# EAGLE design deadlocks (EAGLE 8.7.1)
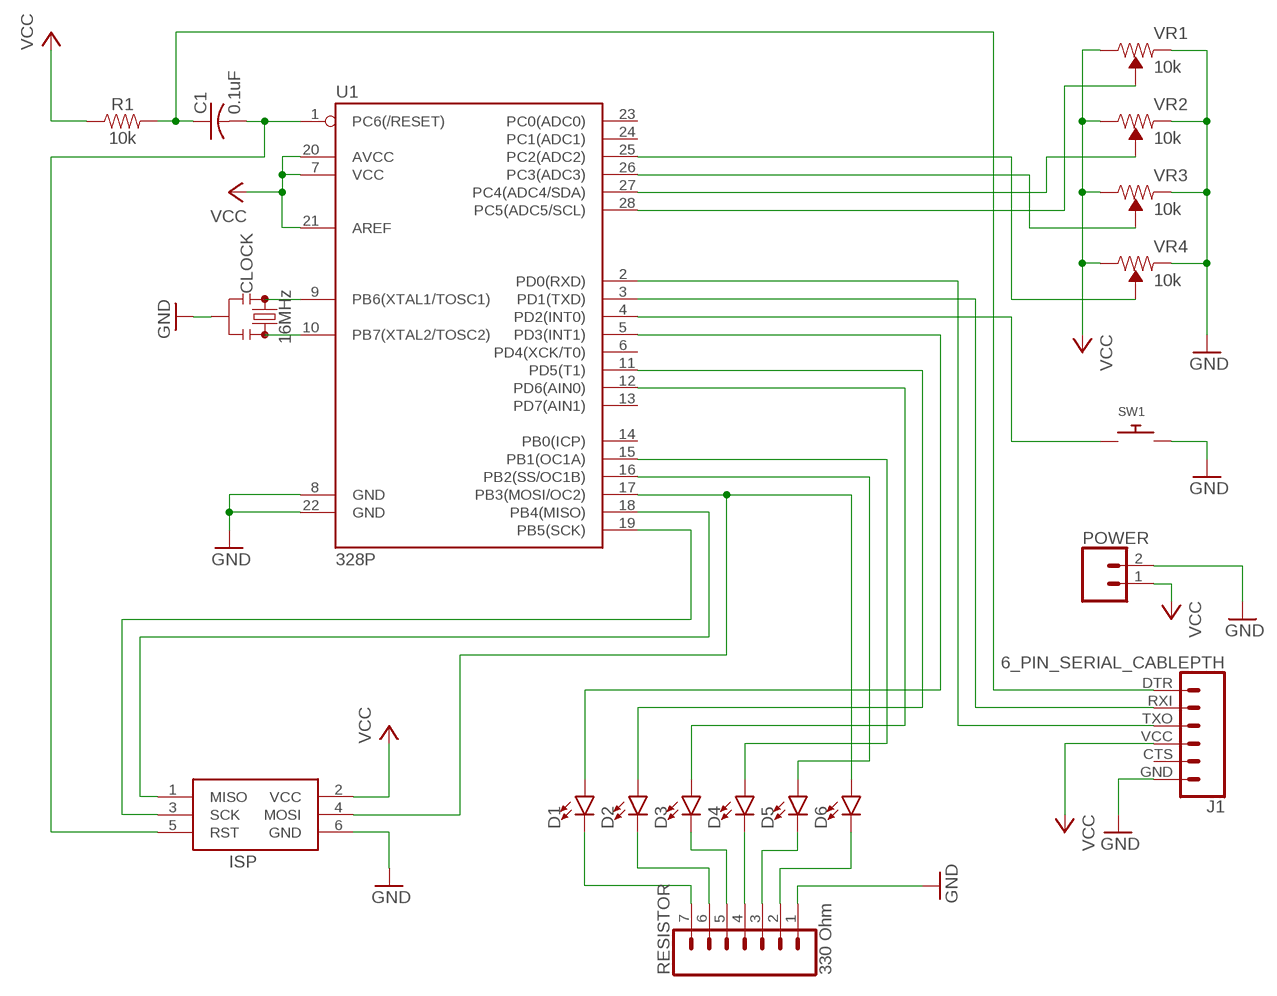
[diagram p0: schematic, sheet 1]

## Parts
C1  0.1uF  C-US025-024X044  [C025-024X044]
CLOCK  16MHz  RESONATORPTH-7.6X3.8  [RESONATOR-PTH-7.6X3.8]
D1  LED5MM  [LED_5MM]
D2  LED5MM  [LED_5MM]
D3  LED5MM  [LED_5MM]
D4  LED5MM  [LED_5MM]
D5  LED5MM  [LED_5MM]
D6  LED5MM  [LED_5MM]
ISP  AVRISP-6  [AVRISP]
J1  6_PIN_SERIAL_CABLEPTH  [FTDI_BASIC]
POWER  CONN_02  [1X02]
R1  10k  10KOHM-HORIZ-1/4W-1%  [AXIAL-0.3]
RESISTOR  330 Ohm  CONN_07  [1X07]
SW1  SWITCH_PUSHBUTTONEVQ-PE  [TACT_PANA-EVQ]
U1  328P  ATMEGA328P_PDIP  [DIP28]
VR1  10k  TRIMPOT-PTH-10MM-KNOB-1/2W-10%  [TRIMPOT-PTH-3386U]
VR2  10k  TRIMPOT-PTH-10MM-KNOB-1/2W-10%  [TRIMPOT-PTH-3386U]
VR3  10k  TRIMPOT-PTH-10MM-KNOB-1/2W-10%  [TRIMPOT-PTH-3386U]
VR4  10k  TRIMPOT-PTH-10MM-KNOB-1/2W-10%  [TRIMPOT-PTH-3386U]

## Nets
GND: CLOCK.2 ISP.6(GND) J1.GND POWER.2 RESISTOR.1 SW1.P$2 U1.8(GND) U1.22(GND) VR1.1(CCW) VR2.1(CCW) VR3.1(CCW) VR4.1(CCW)
N$1: U1.28(PC5(ADC5/SCL)) VR1.2(WIPER)
N$2: CLOCK.1 U1.9(PB6(XTAL1/TOSC1))
N$3: CLOCK.3 U1.10(PB7(XTAL2/TOSC2))
N$4: U1.27(PC4(ADC4/SDA)) VR2.2(WIPER)
N$5: U1.26(PC3(ADC3)) VR3.2(WIPER)
N$6: U1.25(PC2(ADC2)) VR4.2(WIPER)
N$7: J1.RXI U1.3(PD1(TXD))
N$8: J1.TXO U1.2(PD0(RXD))
N$9: ISP.1(MISO) U1.18(PB4(MISO))
N$10: C1.1 J1.DTR R1.P$2
N$11: C1.2 ISP.5(RST) U1.1(PC6(/RESET))
N$12: D6.K(C) RESISTOR.2
N$13: D5.K(C) RESISTOR.3
N$14: D4.K(C) RESISTOR.4
N$15: D3.K(C) RESISTOR.5
N$16: D2.K(C) RESISTOR.6
N$17: D1.K(C) RESISTOR.7
N$18: D6.A ISP.4(MOSI) U1.17(PB3(MOSI/OC2))
N$19: D1.A U1.5(PD3(INT1))
N$20: D2.A U1.11(PD5(T1))
N$21: D3.A U1.12(PD6(AIN0))
N$22: D4.A U1.15(PB1(OC1A))
N$23: D5.A U1.16(PB2(SS/OC1B))
N$24: ISP.3(SCK) U1.19(PB5(SCK))
N$25: SW1.P$1 U1.4(PD2(INT0))
VCC: ISP.2(VCC) J1.VCC POWER.1 R1.P$1 U1.7(VCC) U1.20(AVCC) U1.21(AREF) VR1.3(CW) VR2.3(CW) VR3.3(CW) VR4.3(CW)
Unconnected: J1.CTS U1.6(PD4(XCK/T0)) U1.13(PD7(AIN1)) U1.14(PB0(ICP)) U1.23(PC0(ADC0)) U1.24(PC1(ADC1))

## Library data of the parts
C1 = adafruit:C-US: CAPACITOR, American symbol
CLOCK = SparkFun-Clocks:RESONATOR: Resonators (Generic) Ceramic resonators are clock-generating components, often used to control timing in microcontrollers. They usually have 3 pins: two pins for oscillation, and one pin for ground. Compared to crystals, resonators have worse tolerance, but are usually much cheaper. Plus, they have built-in load capacitors! These devices are used on boards like the Arduino Pro 8MHz <https://www.sparkfun.com/products/11114> and Arduino Pro 16MHz <https://www.sparkfun.com/products/11113>.
D1-D6 = SparkFun-LED:LED: LED (Generic) Standard schematic elements and footprints for 5mm, 3mm, 1206, and 0603 sized LEDs. Generic LEDs with no color specified.
ISP = adafruit:AVRISP: AVR ISP HEADER Standard 6 pin header for AVR programming
J1 = SparkFun-Connectors:6_PIN_SERIAL_CABLE: 6-pin header connection for use with the "FTDI BASIC" pinout - CABLE SIDE. Also known as "Arduino Serial Program Header". This is used on a design to provide a 6-pin connection point for serial communication usually from a USB cable (D+/D-) to these headers (RX/TX). It also has the remaining pins necessary for programming in the Arduino evironment (DTR, GND, and sometimes VCC). Note, this device has "CABLE" in the name. It is intended to be used on a design that usually lives on the end of your USB cable and prvides the converter chip (FTDI232 or FTDI231x) to commnicate serial RX/TX. The "sister" device, named "TARGET" is inteneded to be used on a design that contains a target micro-controller that you wish to program. You can populate with some of these: Female Headers <https://www.sparkfun.com/products/115> (PRT-00115) For reference (or to suit your programming needs) check out these designs: SparkFun FTDI Basic Breakout - 5V <https://www.sparkfun.com/products/9716> (DEV-09716) SparkFun FTDI Basic Breakout - 3.3V <https://www.sparkfun.com/products/9873> (DEV-09873) SparkFun FTDI SmartBasic <https://www.sparkfun.com/products/12935> (DEV-12935) SparkFun Beefy 3 - FTDI Basic Breakout <https://www.sparkfun.com/products/13746> (DEV-13746)
POWER = SparkFun-Connectors:CONN_02: Multi connection point. Often used as Generic Header-pin footprint for 0.1 inch spaced/style header connections On any of the 0.1 inch spaced packages, you can populate with these: Break Away Headers - Straight <https://www.sparkfun.com/products/116> (PRT-00116) Break Away Male Headers - Right Angle <https://www.sparkfun.com/products/553> (PRT-00553) Female Headers <https://www.sparkfun.com/products/115> (PRT-00115) Break Away Headers - Machine Pin <https://www.sparkfun.com/products/117> (PRT-00117) Break Away Female Headers - Swiss Machine Pin <https://www.sparkfun.com/products/743> (PRT-00743) For SCREWTERMINALS and SPRING TERMINALS visit here: Screw Terimnals on SparkFun.com <https://www.sparkfun.com/search/results?term=Screw+Terminals> (5mm/3.5mm/2.54mm spacing) This device is also useful as a general connection point to wire up your design to another part of your project. Our various solder wires solder well into these plated through hole pads. Hook-Up Wire - Assortment (Stranded, 22 AWG) <https://www.sparkfun.com/products/11375> (PRT-11375) Hook-Up Wire - Assortment (Solid Core, 22 AWG) <https://www.sparkfun.com/products/11367> (PRT-11367) View the entire wire category on our website here <https://www.sparkfun.com/categories/141> Special notes: Molex polarized connector foot print use with: PRT-08233 with associated crimp pins and housings. 2.54_SCREWTERM for use with PRT-10571. 3.5mm Screw Terminal footprints for PRT-08084 5mm Screw Terminal footprints for use with PRT-08432
R1 = SparkFun-Resistors:10KOHM: 10kΩ resistor A resistor is a passive two-terminal electrical component that implements electrical resistance as a circuit element. Resistors act to reduce current flow, and, at the same time, act to lower voltage levels within circuits. - Wikipedia; PROD_ID: RES-12183
RESISTOR = SparkFun-Connectors:CONN_07: Multi connection point. Often used as Generic Header-pin footprint for 0.1 inch spaced/style header connections On any of the 0.1 inch spaced packages, you can populate with these: Break Away Headers - Straight <https://www.sparkfun.com/products/116> (PRT-00116) Break Away Male Headers - Right Angle <https://www.sparkfun.com/products/553> (PRT-00553) Female Headers <https://www.sparkfun.com/products/115> (PRT-00115) Break Away Headers - Machine Pin <https://www.sparkfun.com/products/117> (PRT-00117) Break Away Female Headers - Swiss Machine Pin <https://www.sparkfun.com/products/743> (PRT-00743) For SCREWTERMINALS and SPRING TERMINALS visit here: Screw Terimnals on SparkFun.com <https://www.sparkfun.com/search/results?term=Screw+Terminals> (5mm/3.5mm/2.54mm spacing) This device is also useful as a general connection point to wire up your design to another part of your project. Our various solder wires solder well into these plated through hole pads. Hook-Up Wire - Assortment (Stranded, 22 AWG) <https://www.sparkfun.com/products/11375> (PRT-11375) Hook-Up Wire - Assortment (Solid Core, 22 AWG) <https://www.sparkfun.com/products/11367> (PRT-11367) View the entire wire category on our website here <https://www.sparkfun.com/categories/141> Special notes: Molex polarized connector foot print use with SKU : PRT-08231 with associated crimp pins and housings. 1MM SMD Version SKU: PRT-10208 NOTES ON THE VARIANTS LOCK and LOCK_LONGPADS... This footprint was designed to help hold the alignment of a through-hole component (i.e. 6-pin header) while soldering it into place. You may notice that each hole has been shifted either up or down by 0.005 of an inch from it's more standard position (which is a perfectly straight line). This slight alteration caused the pins (the squares in the middle) to touch the edges of the holes. Because they are alternating, it causes a "brace" to hold the component in place. 0.005 has proven to be the perfect amount of "off-center" position when using our standard breakaway headers. Although looks a little odd when you look at the bare footprint, once you have a header in there, the alteration is very hard to notice. Also,if you push a header all the way into place, it is covered up entirely on the bottom side.
SW1 = adafruit:SWITCH_PUSHBUTTON: Buttons SOFTTOUCHSMD_SJ - Soft touch temporary push button (Super Junk Akihabara) Compatible with SKPMANE010 [Mouser: 688-SKPMAN] C&K_KSS = Digikey: KSS221GLFS
U1 = SparkFun-IC-Microcontroller:ATMEGA328P_PDIP: Atmel 328P Through hole ATMEGA328P uC used in the Arduino 32kb flash, 1k EEPROM, 2k SRAM Datasheet <http://www.sparkfun.com/datasheets/Components/SMD/ATMega328.pdf> SparkFun Products Storefront component: AVR 28 Pin 20MHz 32K 6A/D - ATMega328P <https://www.sparkfun.com/products/9061> (COM-09061) SparkFun Simon Says - Through-Hole Soldering Kit <https://www.sparkfun.com/products/10547> (KIT-10547) SparkFun Learn to Solder - Simon Says <https://www.sparkfun.com/products/13708> (KIT-13708) SparkFun BigTime Watch Kit <https://www.sparkfun.com/products/11734> (KIT-11734) SparkFun ClockIt <https://www.sparkfun.com/products/10930> (KIT-10930) SparkFun Serial Enabled LCD Kit <https://www.sparkfun.com/products/10097> (LCD-10097) SparkFun Simon Tilts - Through Hole Soldering Kit <https://www.sparkfun.com/products/12634> (KIT-12634) SparkFun Frequency Counter Kit <https://www.sparkfun.com/products/10140> (KIT-10140) FabFM Radio Kit <https://www.sparkfun.com/products/11043> (KIT-11043) SparkFun Binary Blaster Kit <https://www.sparkfun.com/products/12037> (KIT-12037) SparkFun Metro-Gnome <https://www.sparkfun.com/products/9236> (KIT-09236) ATmega328 with Arduino Optiboot (Uno) <https://www.sparkfun.com/products/10524> (DEV-10524); PROD_ID: IC-09136
VR1-VR4 = SparkFun-Resistors:TRIMPOT: Trimming Potentiometer (Trimpot) Three-terminal potentiometers, with an adjustable wiper and two adjustable resistors. A pot can be used to create a configurable voltage divider, or as a variable resistor. "Trimpots" are a subset of potentiometers, usually intended for "set-and-forget" applications. They're often more delicate than standard potentiometers - rated for fewer turns. Variants PTH-KNOB - PTH Trimpot w/ finger-adjustable knob Trimpot 10K with Knob <https://www.sparkfun.com/products/9806> (COM-09806) Datasheet <http://www.sparkfun.com/datasheets/Components/General/TSR-3386.pdf> SMD-3MM-CLOSED-FRAME - SMD 3mm Square Closed-Frame Trimpot Used on e.g. EasyDriver - Stepper Motor Driver <https://www.sparkfun.com/products/12779> Datasheet <http://www.bitechnologies.com/pdfs/22.pdf> (22AR10KTR) SMD-5MM - SMD 5mm Square Closed-Frame Trimpot Used on e.g. IOIO-OTG - V2.2 <https://www.sparkfun.com/products/13613> Datasheet <http://www.vishay.com/docs/51008/ts53.pdf> (TS53YL502MR10) SMD-3MM-1/10W-25% - 3mm Square Open-Frame Trimpot Used on e.g. SparkFun Shapeoko <https://www.sparkfun.com/products/13899> Datasheet <http://www.bourns.com/docs/Product-Datasheets/TC33.pdf> (TC33X-2-103E); PROD_ID: RES-09730; SF_SKU: COM-09806

## Board
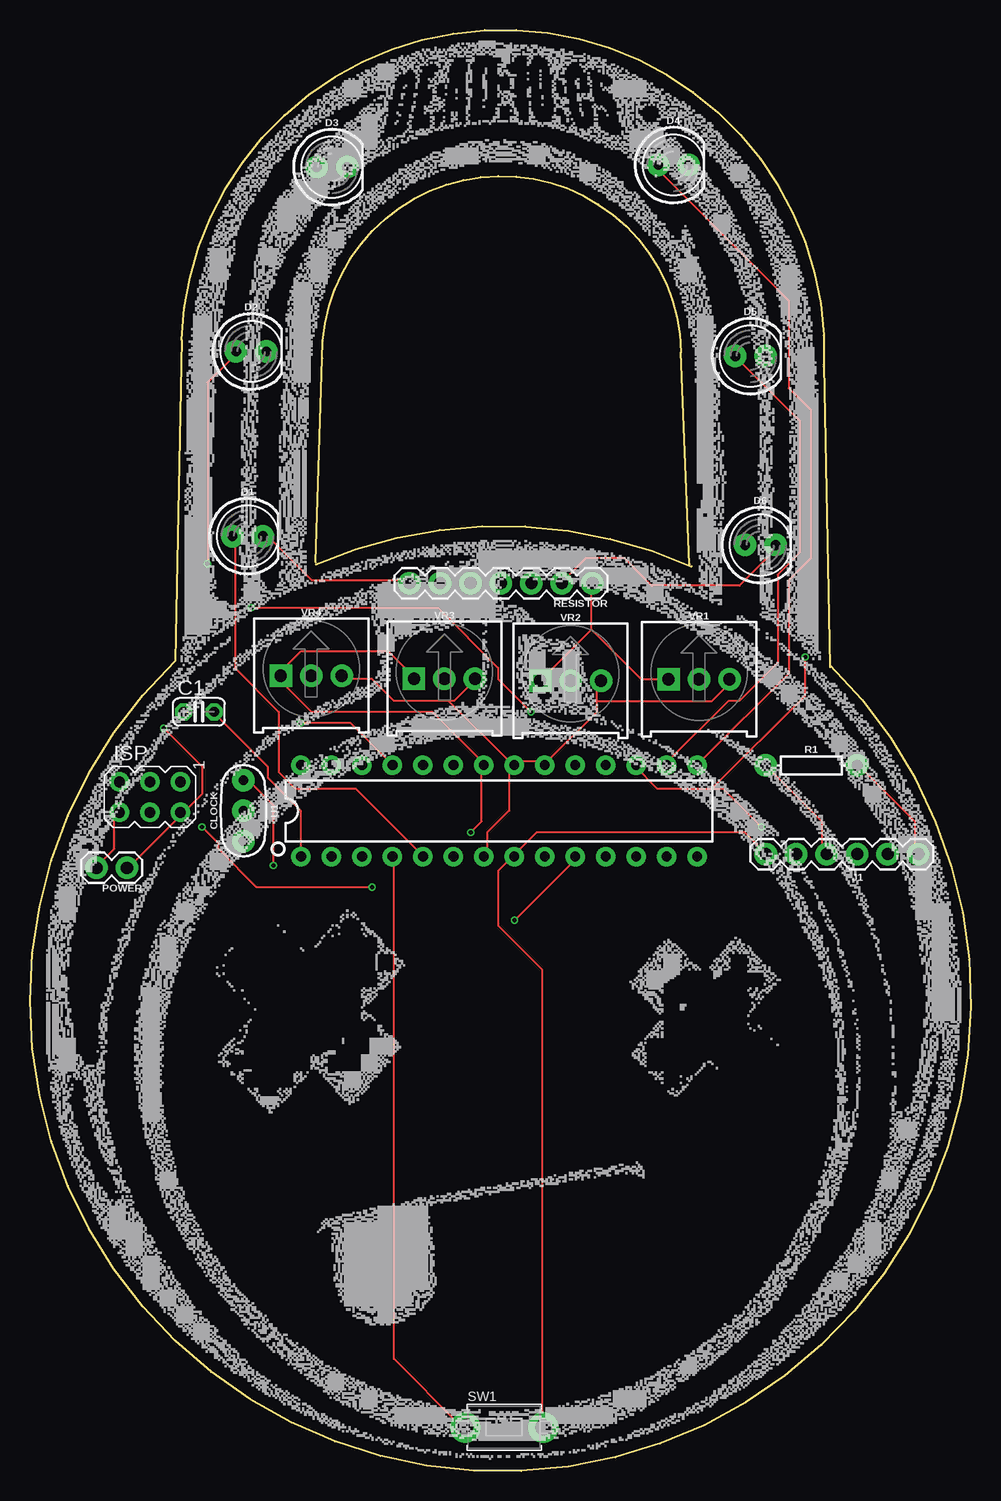
[diagram p1: board, top side]
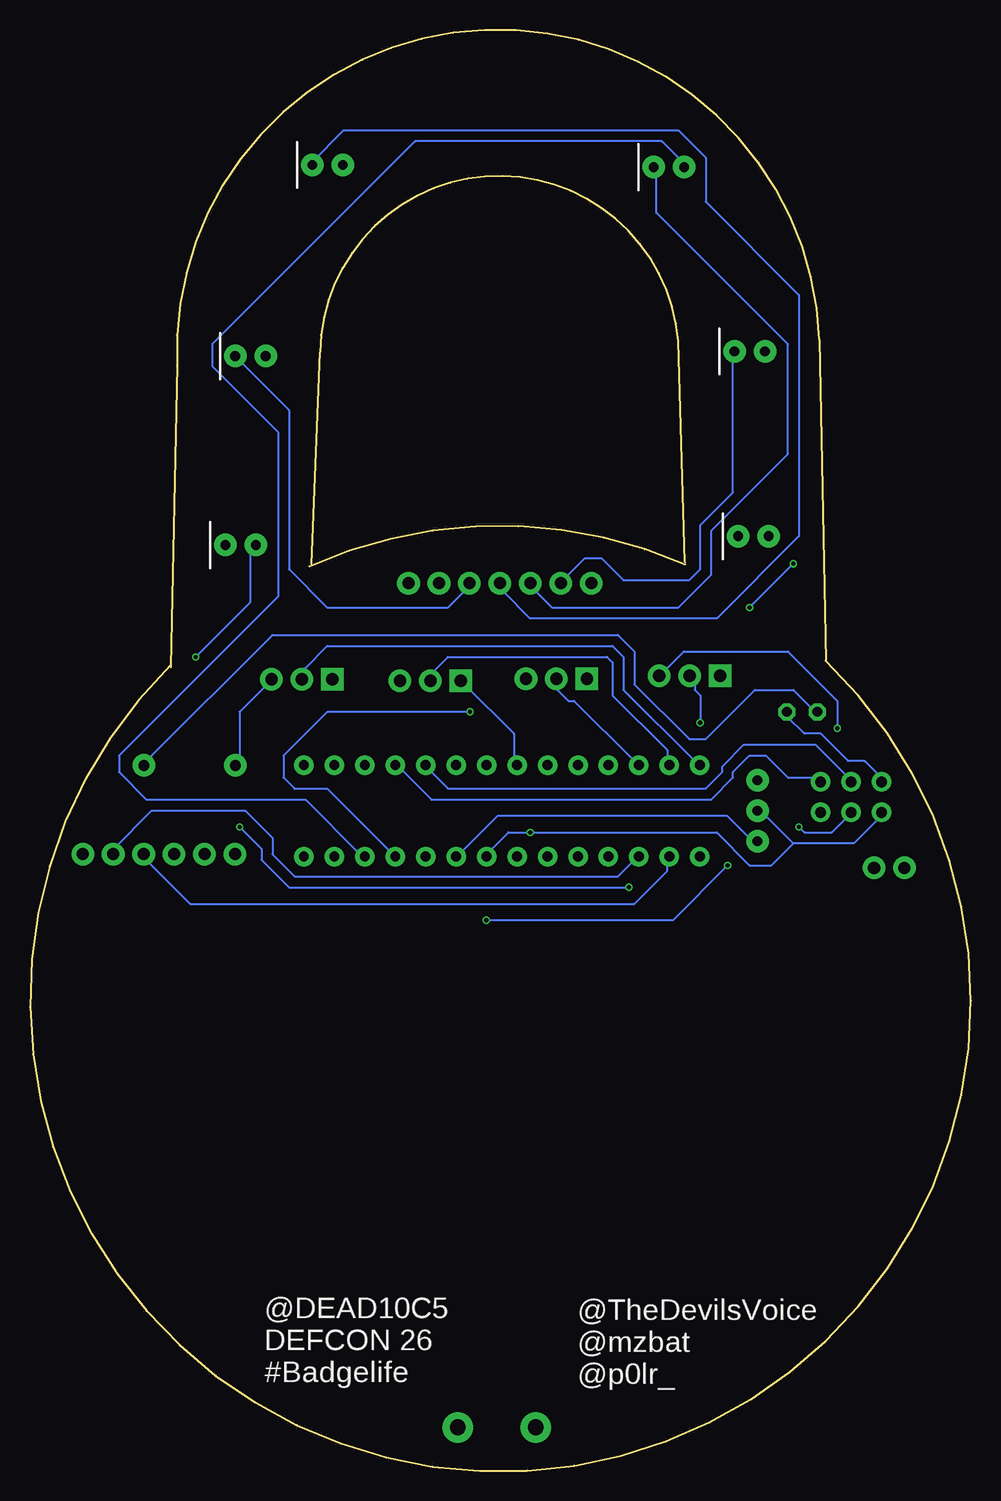
[diagram p2: board, bottom side, seen from below]

Size 78.45 x 120.12 mm. Coordinates in mm from the lower left corner, seen from the top.
Outline: 23.83,75.58 arc-47 55.16,75.41
Outline: 23.83,75.76 24.36,92.73 arc-180 54.28,93.26 54.98,75.58
Outline: 66.18,92.03 arc181 12.63,94.31 12.11,67.53 arc272 66.71,67.18
Outline: 66.18,92.21 66.71,67.01
Copper layers (1*16): Top 0.035559375mm / dielectric 1.6mm / Bottom 0.035559375mm
Design rules "oshpark-2layer": minimum track width 6mil, minimum drill 10mil, track to track 6mil, track to pad 6mil, pad to pad 6mil, via to via 6mil, smd to smd 6mil, copper to edge 15mil, drill to drill 6mil, minimum pad ring 5mil, minimum via ring 5mil, stop-mask expansion 2.5mil, vias tented up to drill 0mil, thermal gap 10mil

### Footprints (pad centres in the part's own frame; a part is rotated, then mirrored left to right if it is on the bottom)
C025-024X044 = drill 0.813 pad 1.422 octagon: 1 -1.27,0; 2 1.27,0
RESONATOR-PTH-7.6X3.8 = drill 0.8 pad 1.88: 1 -2.54,0; 2 0,0; 3 2.54,0
LED_5MM = drill 0.813 pad 1.88: A -1.27,0; K 1.27,0
AVRISP = drill 0.9 pad 1.626: 1 -1.27,2.54; 2 1.27,2.54; 3 -1.27,0; 4 1.27,0; 5 -1.27,-2.54; 6 1.27,-2.54
FTDI_BASIC = drill 1.016 pad 1.88: CTS 10.16,0; DTR 0,0; GND 12.7,0; RXI 2.54,0; TXO 5.08,0; VCC 7.62,0
1X02 = drill 1.016 pad 1.88: 1 0,0; 2 2.54,0
AXIAL-0.3 = drill 0.9 pad 1.88: P$1 -3.81,0; P$2 3.81,0
1X07 = drill 1.016 pad 1.88: 1 0,0; 2 2.54,0; 3 5.08,0; 4 7.62,0; 5 10.16,0; 6 12.7,0; 7 15.24,0
TACT_PANA-EVQ = drill 1.3 pad 2.54: P$1 -3.25,0; P$2 3.25,0
DIP28 = drill 0.813 pad 1.626: 1 -16.51,-3.81; 2 -13.97,-3.81; 3 -11.43,-3.81; 4 -8.89,-3.81; 5 -6.35,-3.81; 6 -3.81,-3.81; 7 -1.27,-3.81; 8 1.27,-3.81; 9 3.81,-3.81; 10 6.35,-3.81; 11 8.89,-3.81; 12 11.43,-3.81; 13 13.97,-3.81; 14 16.51,-3.81; 15 16.51,3.81; 16 13.97,3.81; 17 11.43,3.81; 18 8.89,3.81; 19 6.35,3.81; 20 3.81,3.81; 21 1.27,3.81; 22 -1.27,3.81; 23 -3.81,3.81; 24 -6.35,3.81; 25 -8.89,3.81; 26 -11.43,3.81; 27 -13.97,3.81; 28 -16.51,3.81
TRIMPOT-PTH-3386U = drill 1.016 pad 1.88 square: 1 -2.54,-0.015 | drill 1.016 pad 1.88: 2 0,-0.015; 3 2.54,-0.015

### Placement (x,y rotation side)
C1  14.08,63.28 0 top
CLOCK  17.8,55.04 90 top
D1  18.15,77.93 0 top
D2  18.45,93.33 0 top
D3  25.17,108.69 0 top
D4  53.65,108.87 0 top
D5  60.07,92.94 0 top
D6  60.9,77.19 0 top
ISP  10,56.18 270 top
J1  74.05,51.43 180 top
POWER  8.08,50.28 180 top
R1  65.14,58.82 0 top
RESISTOR  46.89,74.01 180 top
SW1  39.53,3.64 0 top
U1  39.11,55.04 0 top
VR1  55.78,66.01 0 top
VR2  45.07,65.88 0 top
VR3  34.56,66.06 0 top
VR4  23.45,66.31 0 top

### Tracks (layer width: path | path; a pad name or v marks a point on that pad's centre or on a via)
GND  (via drill 0.35)
  Top 0.152: VR3.1 31.71,66.49 29.89,68.32 22.57,68.32 21.2,66.95 21.2,66.49 VR4.1 21.2,66.03 21.2,65.58 23.49,63.29 33.54,63.29 37.66,59.17 U1.22 37.66,58.72 37.66,54.15 v36.74,53.23 | 46.8,70.15 46.8,73.81 RESISTOR.1 | 46.8,70.15 42.69,66.03 VR2.1 | 46.8,70.15 50.92,66.03 53.2,66.03 VR1.1 | ISP.6 7.03,54.6 7.03,51.86 5.65,50.49 POWER.2 | J1.GND 60.98,51.86 59.6,53.23 42.23,53.23 40.4,51.4 U1.8 39.94,50.95 39.03,50.03 39.03,45.46 42.69,41.8 42.69,3.85 SW1.P$2
  Bottom 0.152: U1.22 38.12,59.17 38.12,61.46 42.23,65.58 VR2.1 | 14.8,52.32 17.08,54.6 17.54,54.6 CLOCK.2 | 14.8,52.32 9.77,52.32 7.48,54.6 ISP.6 | 14.8,52.32 16.63,50.49 18.46,50.49 21.2,53.23 v36.74,53.23 38.57,53.23 40.4,51.4 U1.8
N$1
  Bottom 0.152: U1.28 23.03,59.17 28.97,65.12 28.97,67.86 29.89,68.78 53.66,68.78 55.49,66.95 55.49,66.03 VR1.2
N$2
  Bottom 0.152: U1.9 42.69,51.4 39.49,54.6 20.28,54.6 18,52.32 CLOCK.1
N$3  (via drill 0.35)
  Top 0.152: v40.4,45.92 45.43,50.95 U1.10 | v20.28,50.49 20.28,55.52 18,57.8 CLOCK.3
  Bottom 0.152: v40.4,45.92 24.86,45.92 v20.28,50.49
N$4
  Bottom 0.152: U1.27 25.31,59.17 25.31,60.09 29.89,64.66 29.89,67.4 30.34,67.86 43.6,67.86 45.43,66.03 VR2.2
N$5
  Bottom 0.152: U1.26 28.06,59.17 33.09,64.2 33.54,64.2 34.46,65.12 34.46,66.03 VR3.2
N$6  (via drill 0.35)
  Top 0.152: v22.57,62.38 26.69,62.38 29.89,59.17 U1.25
  Bottom 0.152: v22.57,62.38 22.57,64.66 23.03,65.12 23.03,66.03 VR4.2
N$7
  Bottom 0.152: U1.3 28.06,50.95 29.43,49.57 56.4,49.57 58.23,51.4 58.23,52.77 60.52,55.06 68.29,55.06 71.49,51.86 J1.RXI
N$8
  Bottom 0.152: U1.2 25.31,50.95 25.31,50.03 28.06,47.29 65.09,47.29 69.21,51.4 J1.TXO
N$9
  Bottom 0.152: ISP.1 12.97,57.8 15.26,57.8 17.08,59.63 18.46,59.63 19.83,58.26 19.83,57.8 21.66,55.97 44.97,55.97 47.72,58.72 U1.18
N$10
  Top 0.152: J1.DTR 73.78,51.86 73.78,54.15 69.21,58.72 R1.P$2
  Bottom 0.152: C1.1 12.97,63.29 14.8,65.12 18,65.12 22.11,61 23.49,61 28.06,65.58 28.06,68.32 29.43,69.69 58.23,69.69 68.75,59.17 R1.P$2
N$11
  Top 0.152: U1.1 22.57,51.4 22.57,55.06 19.83,57.8 19.83,58.72 15.71,62.83 C1.2
  Bottom 0.152: C1.2 15.26,62.83 13.88,61.46 12.51,61.46 10.23,59.17 8.85,59.17 7.48,57.8 ISP.5
N$12
  Top 0.152: RESISTOR.2 44.52,74.26 46.35,76.09 49.55,76.09 51.83,73.81 59.15,73.81 62.35,77.01 D6.K
N$13
  Bottom 0.152: RESISTOR.3 42.23,73.81 42.23,73.35 43.6,71.98 53.66,71.98 56.86,75.18 56.86,88.44 60.98,92.55 D5.K
N$14
  Bottom 0.152: RESISTOR.4 39.03,73.81 39.03,73.35 36.74,71.06 21.2,71.06 14.34,77.92 14.34,98.04 22.11,105.81 22.11,109.47 24.4,111.75 52.29,111.75 55.03,109.01 D4.K
N$15
  Bottom 0.152: D3.K 26.23,108.55 26.23,104.89 15.26,93.92 15.26,84.78 21.66,78.38 21.66,74.72 24.4,71.98 34.92,71.98 36.74,73.81 RESISTOR.5
N$16
  Bottom 0.152: D2.K 19.83,93.01 19.83,81.58 22.57,78.83 22.57,75.18 23.49,74.26 28.97,74.26 30.8,76.09 32.17,76.09 34,74.26 RESISTOR.6
N$17
  Top 0.152: RESISTOR.7 31.26,74.26 23.49,74.26 19.83,77.92 D1.K
N$18  (via drill 0.35)
  Top 0.152: v14.34,53.69 15.71,52.32 15.71,51.86 18.91,48.66 v28.51,48.66 | v60.98,53.69 57.78,56.89 56.86,56.89 | 56.86,56.89 52.29,56.89 50.46,58.72 U1.17 | v64.63,67.86 64.63,64.66 56.86,56.89
  Bottom 0.152: v14.34,53.69 13.88,53.23 11.6,53.23 10.23,54.6 ISP.4 | v28.51,48.66 56.86,48.66 59.15,50.95 59.15,51.86 v60.98,53.69 | v64.63,67.86 60.06,72.43 60.06,77.01 D6.A
N$19
  Top 0.152: U1.5 32.63,51.4 27.14,56.89 22.11,56.89 20.74,58.26 20.74,63.29 17.08,66.95 17.08,77.92 D1.A
N$20  (via drill 0.35)
  Top 0.152: v41.77,63.29 39.03,66.03 39.03,66.95 34,71.98 v18.46,71.98 | v14.8,75.63 14.8,90.72 17.08,93.01 D2.A
  Bottom 0.152: v41.77,63.29 53.66,63.29 57.32,59.63 57.32,57.8 56.4,56.89 53.66,56.89 48.17,51.4 U1.11 | v14.8,75.63 v18.46,71.98
N$21
  Bottom 0.152: U1.12 50.92,51.4 55.49,55.97 68.75,55.97 71.03,58.26 71.03,59.63 57.78,72.89 57.78,86.61 63.26,92.09 63.26,93.92 46.35,110.84 25.77,110.84 23.94,109.01 D3.A
N$22
  Top 0.152: U1.15 55.95,59.17 63.26,66.49 63.26,74.26 65.09,76.09 65.09,88.44 63.26,90.26 63.26,97.58 52.29,108.55 D4.A
N$23
  Top 0.152: U1.16 53.2,59.17 58.23,64.2 59.15,64.2 62.35,67.4 62.35,74.72 64.18,76.55 64.18,87.52 59.15,92.55 D5.A
N$24
  Bottom 0.152: ISP.3 10.23,57.8 12.97,60.55 18.91,60.55 20.74,58.72 20.74,58.26 22.11,56.89 43.6,56.89 45.43,58.72 U1.19
N$25
  Top 0.152: U1.4 30.34,50.95 30.34,9.34 35.83,3.85 SW1.P$1
VCC  (via drill 0.35)
  Top 0.152: 40.58,58.78 U1.21 | 42.58,58.78 U1.20 | U1.20 42.69,59.17 40.4,59.17 U1.21 | J1.VCC 66,51.86 66,54.15 61.43,58.72 R1.P$1 | U1.7 38.12,51.4 38.12,53.23 39.94,55.06 39.94,58.72 U1.21 | 47.26,64.2 47.26,63.29 43.14,59.17 U1.20 | 47.26,64.2 47.26,65.58 VR2.3 | 47.26,64.2 56.86,64.2 58.23,65.58 VR1.3 | POWER.1 8.4,50.49 12.51,54.6 ISP.2 12.97,55.06 14.34,56.43 14.34,58.72 v11.14,61.92 | 34.92,64.2 35.37,64.2 37.2,66.03 VR3.3 | 34.92,64.2 30.34,64.2 28.51,66.03 26.23,66.03 VR4.3 | 34.92,64.2 39.94,59.17 U1.21
  Bottom 0.152: R1.P$1 60.98,59.17 60.98,63.29 58.69,65.58 VR1.3 | v11.14,61.92 11.14,64.2 15.26,68.32 23.94,68.32 25.77,66.49 VR4.3

### Text on the board
bPlace: @TheDevilsVoice / @mzbat / @p0lr_ | @DEAD10C5 / DEFCON 26 / #Badgelife